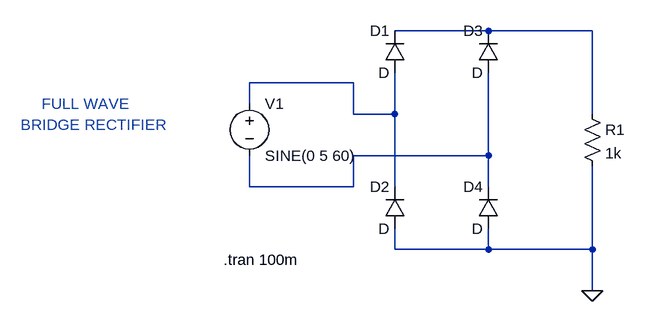
[diagram p0: schematic Fullwave bridge rectifier.asc]
Fullwave bridge rectifier.asc, the LTspice schematic file:
Version 4
SHEET 1 880 680
WIRE 416 16 272 16
WIRE 576 16 416 16
WIRE 208 96 48 96
WIRE 48 128 48 96
WIRE 208 144 208 96
WIRE 272 144 272 80
WIRE 272 144 208 144
WIRE 576 144 576 16
WIRE 416 208 416 80
WIRE 416 208 208 208
WIRE 48 256 48 208
WIRE 208 256 208 208
WIRE 208 256 48 256
WIRE 272 256 272 144
WIRE 416 256 416 208
WIRE 272 352 272 320
WIRE 416 352 416 320
WIRE 416 352 272 352
WIRE 576 352 576 224
WIRE 576 352 416 352
WIRE 576 416 576 352
FLAG 576 416 0
SYMBOL voltage 48 112 R0
WINDOW 123 0 0 Left 0
WINDOW 39 0 0 Left 0
SYMATTR InstName V1
SYMATTR Value SINE(0 5 60)
SYMBOL diode 288 80 R180
WINDOW 0 24 64 Left 2
WINDOW 3 24 0 Left 2
SYMATTR InstName D1
SYMBOL diode 288 320 R180
WINDOW 0 24 64 Left 2
WINDOW 3 24 0 Left 2
SYMATTR InstName D2
SYMBOL diode 432 80 R180
WINDOW 0 24 64 Left 2
WINDOW 3 24 0 Left 2
SYMATTR InstName D3
SYMBOL diode 432 320 R180
WINDOW 0 24 64 Left 2
WINDOW 3 24 0 Left 2
SYMATTR InstName D4
SYMBOL res 560 128 R0
SYMATTR InstName R1
SYMATTR Value 1k
TEXT 8 368 Left 2 !.tran 100m
TEXT -272 128 Left 2 ;FULL WAVE
TEXT -304 160 Left 2 ;BRIDGE RECTIFIER

The netlist it stands for:
* Fullwave bridge rectifier.asc
V1 N002 N003 SINE(0 5 60)
D1 N002 N001 D
D2 0 N002 D
D3 N003 N001 D
D4 0 N003 D
R1 N001 0 1k
.model D D
.lib standard.dio
.tran 100m
* FULL WAVE
* BRIDGE RECTIFIER
.backanno
.end